# EAGLE design RGB LED 1.3 (EAGLE 5.04)
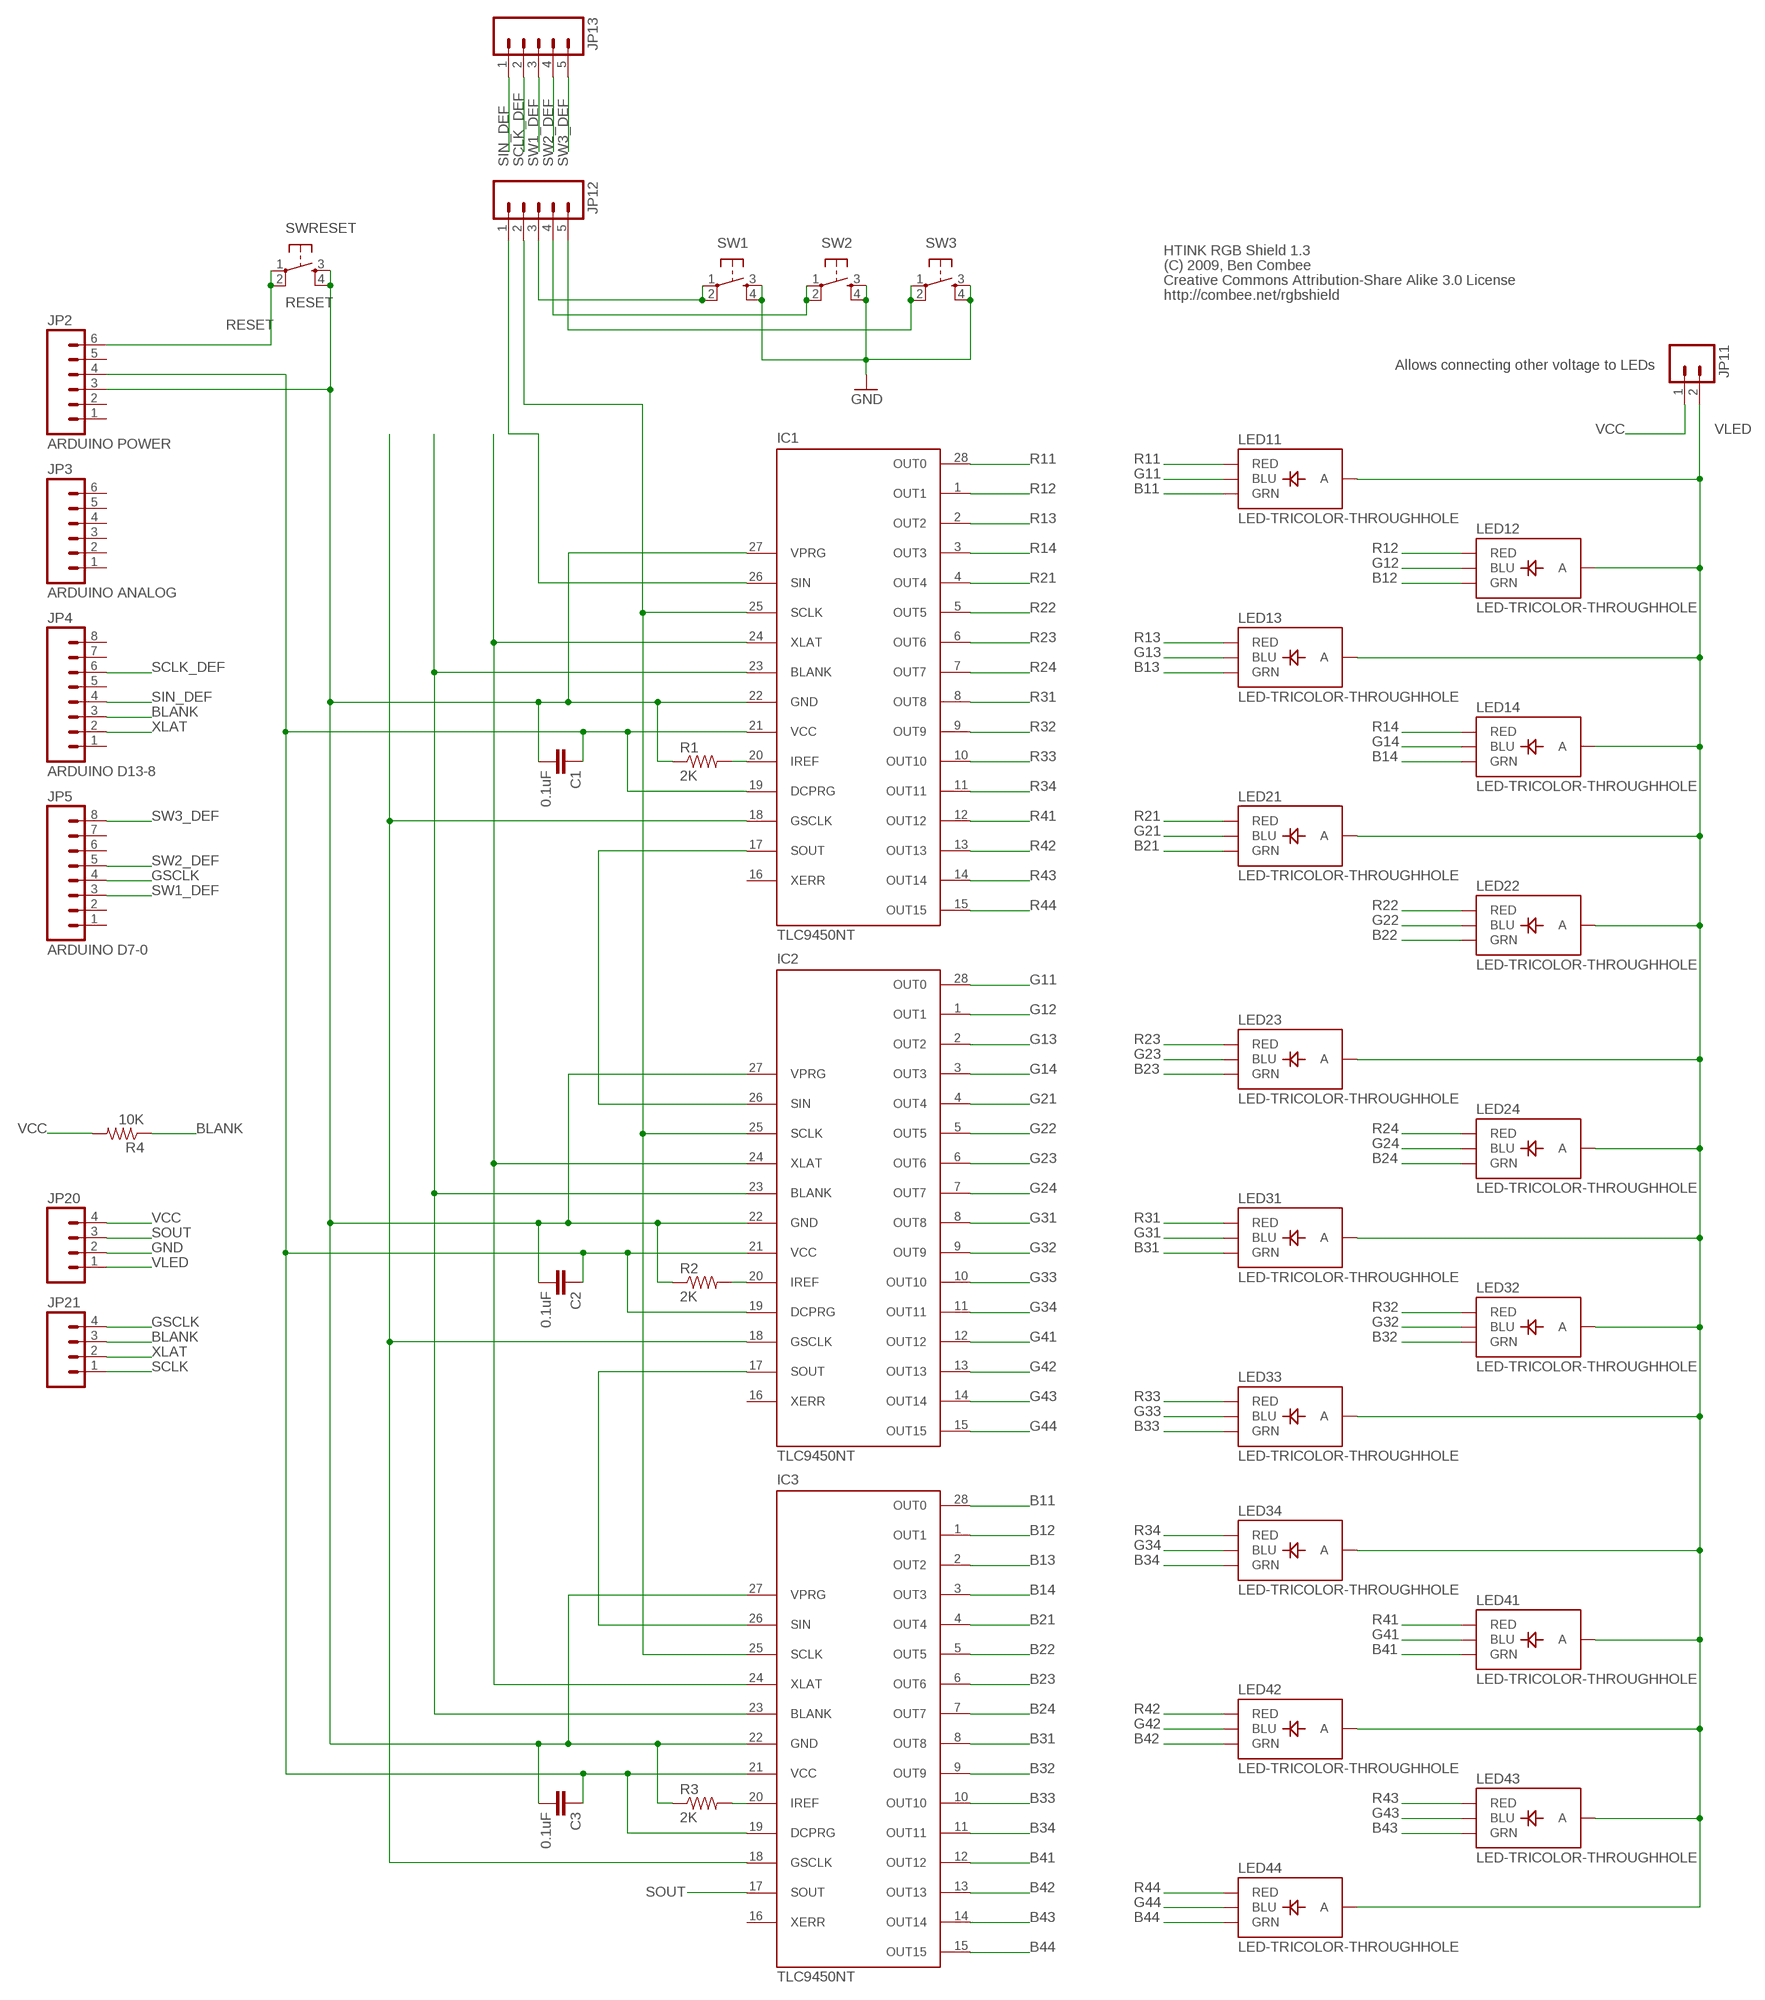
[diagram p0: schematic, sheet 1]

## Parts
C1  0.1uF  CAPPTH  [CAP-PTH-SMALL]
C2  0.1uF  CAPPTH  [CAP-PTH-SMALL]
C3  0.1uF  CAPPTH  [CAP-PTH-SMALL]
IC1  TLC9450NT  [DIL28-3]
IC2  TLC9450NT  [DIL28-3]
IC3  TLC9450NT  [DIL28-3]
JP2  ARDUINO POWER  M06LOCK  [1X06_LOCK]
JP3  ARDUINO ANALOG  M06LOCK  [1X06_LOCK]
JP4  ARDUINO D13-8  M08LOCK  [1X08_LOCK]
JP5  ARDUINO D7-0  M08LOCK  [1X08_LOCK]
JP11  M02LOCK  [1X02_LOCK]
JP12  M05LOCK  [1X05_LOCK]
JP13  M05LOCK  [1X05_LOCK]
JP20  M04LOCK  [1X04_LOCK]
JP21  M04LOCK  [1X04_LOCK]
LED11  LED-TRICOLOR-THROUGHHOLE  [LED-TRICOLOR-THROUGHHOLE]
LED12  LED-TRICOLOR-THROUGHHOLE  [LED-TRICOLOR-THROUGHHOLE]
LED13  LED-TRICOLOR-THROUGHHOLE  [LED-TRICOLOR-THROUGHHOLE]
LED14  LED-TRICOLOR-THROUGHHOLE  [LED-TRICOLOR-THROUGHHOLE]
LED21  LED-TRICOLOR-THROUGHHOLE  [LED-TRICOLOR-THROUGHHOLE]
LED22  LED-TRICOLOR-THROUGHHOLE  [LED-TRICOLOR-THROUGHHOLE]
LED23  LED-TRICOLOR-THROUGHHOLE  [LED-TRICOLOR-THROUGHHOLE]
LED24  LED-TRICOLOR-THROUGHHOLE  [LED-TRICOLOR-THROUGHHOLE]
LED31  LED-TRICOLOR-THROUGHHOLE  [LED-TRICOLOR-THROUGHHOLE]
LED32  LED-TRICOLOR-THROUGHHOLE  [LED-TRICOLOR-THROUGHHOLE]
LED33  LED-TRICOLOR-THROUGHHOLE  [LED-TRICOLOR-THROUGHHOLE]
LED34  LED-TRICOLOR-THROUGHHOLE  [LED-TRICOLOR-THROUGHHOLE]
LED41  LED-TRICOLOR-THROUGHHOLE  [LED-TRICOLOR-THROUGHHOLE]
LED42  LED-TRICOLOR-THROUGHHOLE  [LED-TRICOLOR-THROUGHHOLE]
LED43  LED-TRICOLOR-THROUGHHOLE  [LED-TRICOLOR-THROUGHHOLE]
LED44  LED-TRICOLOR-THROUGHHOLE  [LED-TRICOLOR-THROUGHHOLE]
R1  2K  R-US_0309/12  [0309/12]
R2  2K  R-US_0309/12  [0309/12]
R3  2K  R-US_0309/12  [0309/12]
R4  10K  R-US_0309/12  [0309/12]
SW1  TAC_SWITCHPTH  [TACTILE-PTH]
SW2  TAC_SWITCHPTH  [TACTILE-PTH]
SW3  TAC_SWITCHPTH  [TACTILE-PTH]
SWRESET  RESET  TAC_SWITCHPTH  [TACTILE-PTH]

## Nets
B11: IC3.28(OUT0) LED11.GRN
B12: IC3.1(OUT1) LED12.GRN
B13: IC3.2(OUT2) LED13.GRN
B14: IC3.3(OUT3) LED14.GRN
B21: IC3.4(OUT4) LED21.GRN
B22: IC3.5(OUT5) LED22.GRN
B23: IC3.6(OUT6) LED23.GRN
B24: IC3.7(OUT7) LED24.GRN
B31: IC3.8(OUT8) LED31.GRN
B32: IC3.9(OUT9) LED32.GRN
B33: IC3.10(OUT10) LED33.GRN
B34: IC3.11(OUT11) LED34.GRN
B41: IC3.12(OUT12) LED41.GRN
B42: IC3.13(OUT13) LED42.GRN
B43: IC3.14(OUT14) LED43.GRN
B44: IC3.15(OUT15) LED44.GRN
BLANK: IC1.23(BLANK) IC2.23(BLANK) IC3.23(BLANK) JP4.3 JP21.3 R4.1
G11: IC2.28(OUT0) LED11.BLU
G12: IC2.1(OUT1) LED12.BLU
G13: IC2.2(OUT2) LED13.BLU
G14: IC2.3(OUT3) LED14.BLU
G21: IC2.4(OUT4) LED21.BLU
G22: IC2.5(OUT5) LED22.BLU
G23: IC2.6(OUT6) LED23.BLU
G24: IC2.7(OUT7) LED24.BLU
G31: IC2.8(OUT8) LED31.BLU
G32: IC2.9(OUT9) LED32.BLU
G33: IC2.10(OUT10) LED33.BLU
G34: IC2.11(OUT11) LED34.BLU
G41: IC2.12(OUT12) LED41.BLU
G42: IC2.13(OUT13) LED42.BLU
G43: IC2.14(OUT14) LED43.BLU
G44: IC2.15(OUT15) LED44.BLU
GND: C1.2 C2.2 C3.2 IC1.22(GND) IC1.27(VPRG) IC2.22(GND) IC2.27(VPRG) IC3.22(GND) IC3.27(VPRG) JP2.3 JP20.2 R1.1 R2.1 R3.1 SW1.3 SW1.4 SW2.3 SW2.4 SW3.3 SW3.4 SWRESET.3 SWRESET.4
GSCLK: IC1.18(GSCLK) IC2.18(GSCLK) IC3.18(GSCLK) JP5.4 JP21.4
N$1: IC1.17(SOUT) IC2.26(SIN)
N$2: IC2.17(SOUT) IC3.26(SIN)
N$3: JP12.3 SW1.1 SW1.2
N$4: IC3.20(IREF) R3.2
N$5: IC2.20(IREF) R2.2
N$6: IC1.20(IREF) R1.2
N$32: JP12.4 SW2.1 SW2.2
N$33: JP12.5 SW3.1 SW3.2
R11: IC1.28(OUT0) LED11.RED
R12: IC1.1(OUT1) LED12.RED
R13: IC1.2(OUT2) LED13.RED
R14: IC1.3(OUT3) LED14.RED
R21: IC1.4(OUT4) LED21.RED
R22: IC1.5(OUT5) LED22.RED
R23: IC1.6(OUT6) LED23.RED
R24: IC1.7(OUT7) LED24.RED
R31: IC1.8(OUT8) LED31.RED
R32: IC1.9(OUT9) LED32.RED
R33: IC1.10(OUT10) LED33.RED
R34: IC1.11(OUT11) LED34.RED
R41: IC1.12(OUT12) LED41.RED
R42: IC1.13(OUT13) LED42.RED
R43: IC1.14(OUT14) LED43.RED
R44: IC1.15(OUT15) LED44.RED
RESET: JP2.6 SWRESET.1 SWRESET.2
SCLK: IC1.25(SCLK) IC2.25(SCLK) IC3.25(SCLK) JP12.2 JP21.1
SCLK_DEF: JP4.6 JP13.2
SIN: IC1.26(SIN) JP12.1
SIN_DEF: JP4.4 JP13.1
SOUT: IC3.17(SOUT) JP20.3
SW1_DEF: JP5.3 JP13.3
SW2_DEF: JP5.5 JP13.4
SW3_DEF: JP5.8 JP13.5
VCC: C1.1 C2.1 C3.1 IC1.19(DCPRG) IC1.21(VCC) IC2.19(DCPRG) IC2.21(VCC) IC3.19(DCPRG) IC3.21(VCC) JP2.4 JP11.1 JP20.4 R4.2
VLED: JP11.2 JP20.1 LED11.GND(A) LED12.GND(A) LED13.GND(A) LED14.GND(A) LED21.GND(A) LED22.GND(A) LED23.GND(A) LED24.GND(A) LED31.GND(A) LED32.GND(A) LED33.GND(A) LED34.GND(A) LED41.GND(A) LED42.GND(A) LED43.GND(A) LED44.GND(A)
XLAT: IC1.24(XLAT) IC2.24(XLAT) IC3.24(XLAT) JP4.2 JP21.2
Unconnected: IC1.16(XERR) IC2.16(XERR) IC3.16(XERR) JP2.1 JP2.2 JP2.5 JP3.1 JP3.2 JP3.3 JP3.4 JP3.5 JP3.6 JP4.1 JP4.5 JP4.7 JP4.8 JP5.1 JP5.2 JP5.6 JP5.7

## Notes on the sheet
- HTINK RGB Shield 1.3
- (C) 2009, Ben Combee
- Creative Commons Attribution-Share Alike 3.0 License
- http://combee.net/rgbshield
- Allows connecting other voltage to LEDs

## Library data of the parts
C1-C3 = SparkFun:CAP: Capacitor Standard 0603 ceramic capacitor, and 0.1" leaded capacitor.
IC1-IC3 = combee:TLC9450NT: TI TLC5940 16 Channel LED Driver
JP2 JP3 = SparkFun:M06: Header 6 Standard 6-pin 0.1" header. Use with straight break away headers (SKU : PRT-00116), right angle break away headers (PRT-00553), swiss pins (PRT-00743), machine pins (PRT-00117), and female headers (PRT-00115). Molex polarized connector foot print use with SKU : PRT-08094 with associated crimp pins and housings. NOTES ON THE VARIANTS LOCK and LOCK_LONGPADS... This footprint was designed to help hold the alignment of a through-hole component (i.e. 6-pin header) while soldering it into place. You may notice that each hole has been shifted either up or down by 0.005 of an inch from it's more standard position (which is a perfectly straight line). This slight alteration caused the pins (the squares in the middle) to touch the edges of the holes. Because they are alternating, it causes a "brace" to hold the component in place. 0.005 has proven to be the perfect amount of "off-center" position when using our standard breakaway headers. Although looks a little odd when you look at the bare footprint, once you have a header in there, the alteration is very hard to notice. Also, if you push a header all the way into place, it is covered up entirely on the bottom side. This idea of altering the position of holes to aid alignment will be further integrated into the Sparkfun Library for other footprints. It can help hold any component with 3 or more connection pins.
JP4 JP5 = SparkFun:M08: Header 8 Standard 8-pin 0.1" header. Use with straight break away headers (SKU : PRT-00116), right angle break away headers (PRT-00553), swiss pins (PRT-00743), machine pins (PRT-00117), and female headers (PRT-00115).
JP11 = SparkFun:M02: Header 2 Standard 2-pin 0.1" header. Use with straight break away headers (SKU : PRT-00116), right angle break away headers (PRT-00553), swiss pins (PRT-00743), machine pins (PRT-00117), and female headers (PRT-00115). Molex polarized connector foot print use with SKU : PRT-08233 with associated crimp pins and housings.
JP12 JP13 = SparkFun:M05: Header 5 Standard 5-pin 0.1" header. Use with straight break away headers (SKU : PRT-00116), right angle break away headers (PRT-00553), swiss pins (PRT-00743), machine pins (PRT-00117), and female headers (PRT-00115). Molex polarized connector foot print use with SKU : PRT-08230 with associated crimp pins and housings.
JP20 JP21 = SparkFun:M04: Header 4 Standard 4-pin 0.1" header. Use with straight break away headers (SKU : PRT-00116), right angle break away headers (PRT-00553), swiss pins (PRT-00743), machine pins (PRT-00117), and female headers (PRT-00115). Molex polarized connector foot print use with SKU : PRT-08231 with associated crimp pins and housings.
LED11-LED14 LED21-LED24 LED31-LED34 LED41-LED44 = SparkFun:LED-TRICOLOR-THROUGHHOLE
R1-R4 = resistor:R-US_: RESISTOR, American symbol
SW1-SW3 SWRESET = SparkFun:TAC_SWITCH: Momentary Switch Button commonly used for reset or general input. Spark Fun Electronics SKU : COM-00097

## Board
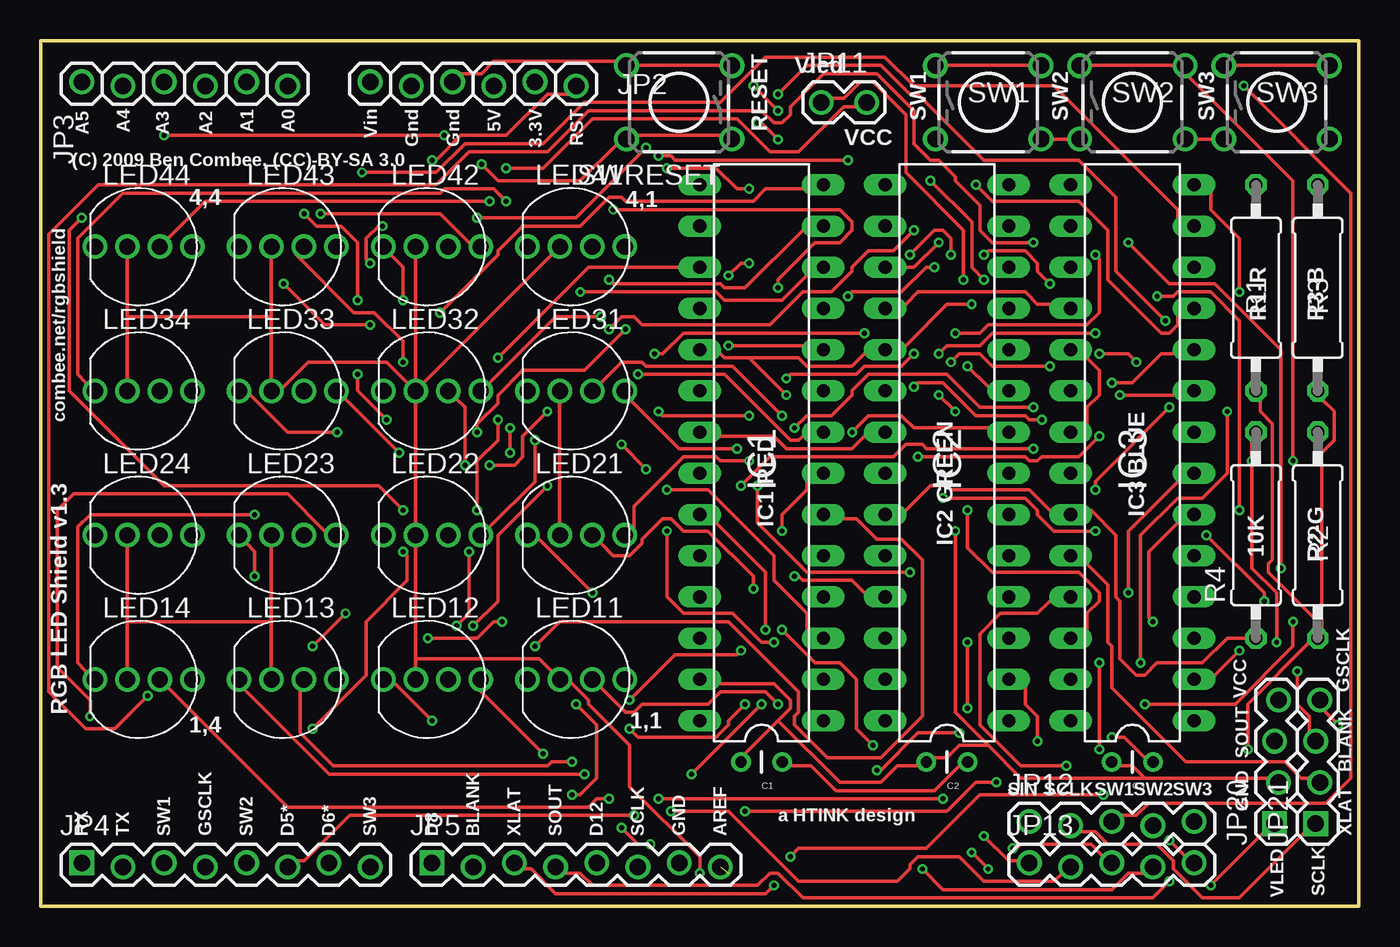
[diagram p1: board, top side]
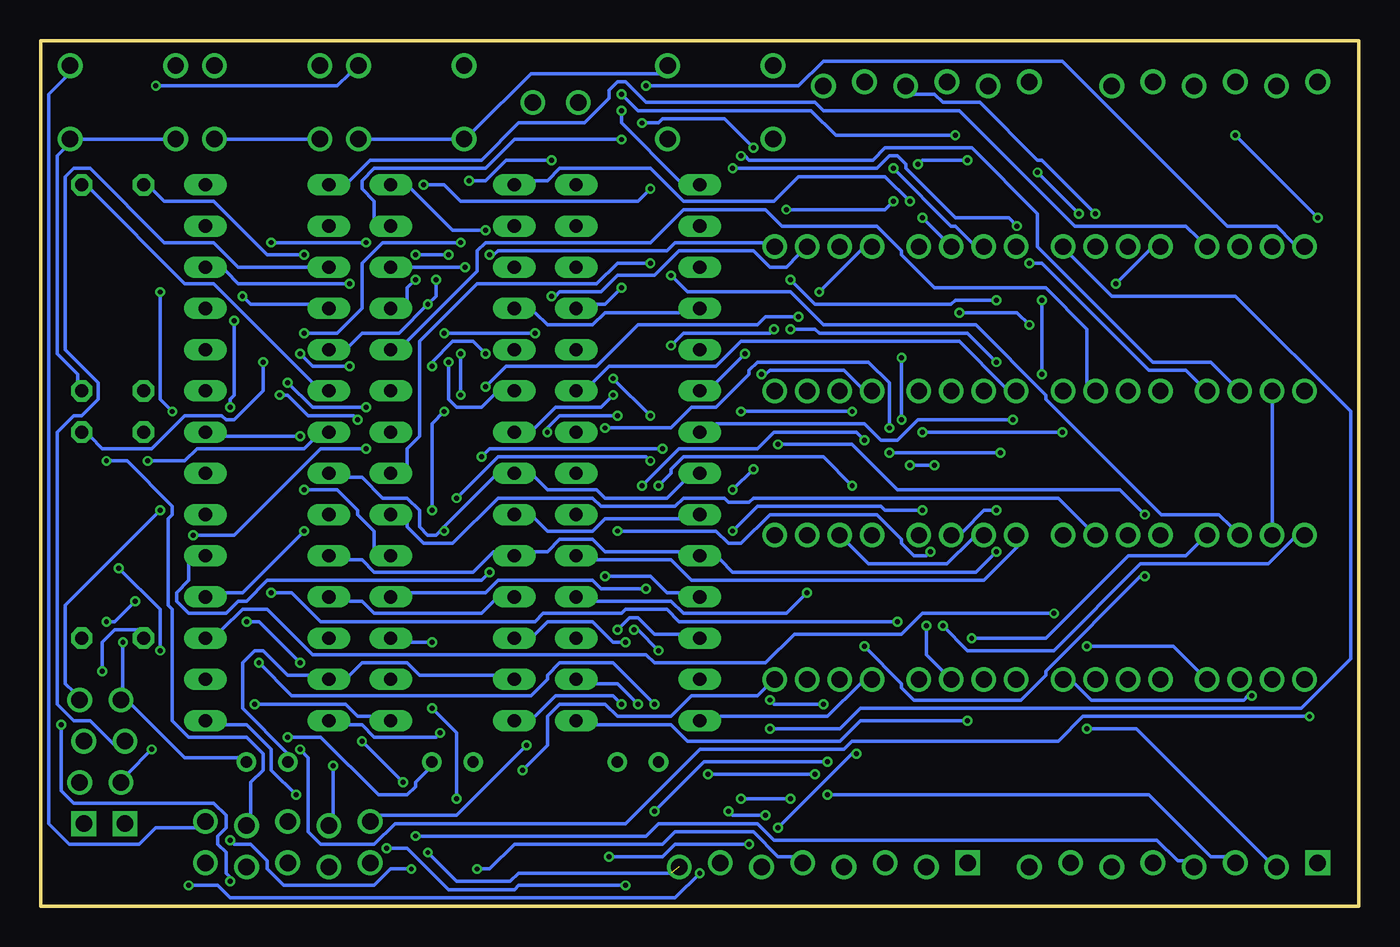
[diagram p2: board, bottom side, seen from below]

Size 81.28 x 53.34 mm. Coordinates in mm from the lower left corner, seen from the top.
Outline: 0,0 81.28,0 81.28,53.34 0,53.34 0,0
Copper layers (1*16): Top 0.035mm / dielectric 1.5mm / Bottom 0.035mm
Design rules "rule_manufacture": minimum track width 8mil, minimum drill 12mil, track to track 8mil, track to pad 8mil, pad to pad 6mil, via to via 10mil, smd to smd 0mil, copper to edge 10mil, drill to drill 10mil, minimum pad ring 10mil, minimum via ring 6mil, stop-mask expansion 2mil, vias tented up to drill 25mil, thermal gap 10mil

### Footprints (pad centres in the part's own frame; a part is rotated, then mirrored left to right if it is on the bottom)
CAP-PTH-SMALL = drill 0.7 round: 1 0,0; 2 2.54,0
DIL28-3 = drill 0.813 long: 1 -16.51,-3.81; 2 -13.97,-3.81; 3 -11.43,-3.81; 4 -8.89,-3.81; 5 -6.35,-3.81; 6 -3.81,-3.81; 7 -1.27,-3.81; 8 1.27,-3.81; 9 3.81,-3.81; 10 6.35,-3.81; 11 8.89,-3.81; 12 11.43,-3.81; 13 13.97,-3.81; 14 16.51,-3.81; 15 16.51,3.81; 16 13.97,3.81; 17 11.43,3.81; 18 8.89,3.81; 19 6.35,3.81; 20 3.81,3.81; 21 1.27,3.81; 22 -1.27,3.81; 23 -3.81,3.81; 24 -6.35,3.81; 25 -8.89,3.81; 26 -11.43,3.81; 27 -13.97,3.81; 28 -16.51,3.81
1X06_LOCK = drill 1.016 round: 1 0,0; 2 2.54,-0.254; 3 5.08,0; 4 7.62,-0.254; 5 10.16,0; 6 12.7,-0.254
1X08_LOCK = drill 1.016 square: 1 0,0.127 | drill 1.016 round: 2 2.54,-0.127; 3 5.08,0.127; 4 7.62,-0.127; 5 10.16,0.127; 6 12.7,-0.127; 7 15.24,0.127; 8 17.78,-0.127
1X02_LOCK = drill 1.016 round: 1 -0.127,0; 2 2.667,0
1X05_LOCK = drill 1.016 round: 1 0,0.127; 2 2.54,-0.127; 3 5.08,0.127; 4 7.62,-0.127; 5 10.16,0.127
1X04_LOCK = drill 1.016 square: 1 0,0.127 | drill 1.016 round: 2 2.54,-0.127; 3 5.08,0.127; 4 7.62,-0.127
LED-TRICOLOR-THROUGHHOLE = drill 1 round: BLU 1,0; GND -1,0; GRN 3,0; RED -3,0
0309/12 = drill 0.813 octagon: 1 -6.35,0; 2 6.35,0
TACTILE-PTH = drill 1.016 round: 1 -3.251,2.261; 2 3.251,2.261; 3 -3.251,-2.261; 4 3.251,-2.261

### Placement (x,y rotation side)
C1  45.72,8.89 180 top
C2  57.15,8.89 180 top
C3  68.58,8.89 180 top
IC1  44.45,27.94 90 top
IC2  55.88,27.94 90 top
IC3  67.31,27.94 90 top
JP2  20.32,50.8 0 top
JP3  2.54,50.8 0 top
JP4  2.54,2.54 0 top
JP5  24.13,2.54 0 top
JP11  48.26,49.53 0 top
JP12  60.96,5.08 0 top
JP13  60.96,2.54 0 top
JP20  76.2,5.08 90 top
JP21  78.74,5.08 90 top
LED11  33.02,13.97 0 top
LED12  24.13,13.97 0 top
LED13  15.24,13.97 0 top
LED14  6.35,13.97 0 top
LED21  33.02,22.86 0 top
LED22  24.13,22.86 0 top
LED23  15.24,22.86 0 top
LED24  6.35,22.86 0 top
LED31  33.02,31.75 0 top
LED32  24.13,31.75 0 top
LED33  15.24,31.75 0 top
LED34  6.35,31.75 0 top
LED41  33.02,40.64 0 top
LED42  24.13,40.64 0 top
LED43  15.24,40.64 0 top
LED44  6.35,40.64 0 top
R1  74.93,38.1 90 top
R2  78.74,22.86 90 top
R3  78.74,38.1 90 top
R4  74.93,22.86 90 top
SW1  58.42,49.53 0 top
SW2  67.31,49.53 0 top
SW3  76.2,49.53 0 top
SWRESET  39.37,49.53 180 top

### Tracks (layer width: path | path; a pad name or v marks a point on that pad's centre or on a via)
B11  (via drill 0.3)
  Top 0.203: v56.64,10.67 54.1,10.67 51.82,8.38 v51.56,8.38
  Bottom 0.203: v56.64,10.67 56.9,10.41 60.71,10.41 61.47,11.18 62.23,11.18 IC3.28 | v51.56,8.38 50.04,9.91 50.04,11.68 49.28,12.45 46.48,12.45 45.72,11.68 42.42,11.68 41.15,12.95 37.08,12.95 36.58,13.46 LED11.GRN
B12  (via drill 0.3)
  Top 0.203: v65.53,6.86 57.91,6.86 54.61,3.56 46.74,3.56 v46.23,3.05 | v37.59,3.81 36.83,3.81 v35.81,4.83 | v30.99,9.4 26.92,13.46 LED12.GRN
  Bottom 0.203: v65.53,6.86 67.06,8.38 67.06,9.65 68.58,11.18 69.85,11.18 IC3.1 | v46.23,3.05 42.93,3.05 42.16,3.81 v37.59,3.81 | v35.81,4.83 31.24,9.4 v30.99,9.4
B13  (via drill 0.3)
  Top 0.203: v73.91,15.75 72.39,14.22 IC3.2 | v76.45,20.83 76.45,34.29 72.39,38.35 69.6,38.35 v67.06,40.89 | v61.21,40.89 58.67,40.89 57.91,41.66 57.91,43.18 56.39,44.7 56.39,44.96 55.37,45.97 54.86,45.97 53.85,46.99 53.85,49.02 51.56,51.31 48.26,51.31 46.23,49.28 46.23,48.77 45.72,48.26 45.21,48.26 44.45,49.02 33.78,49.02 31.24,46.48 26.42,46.48 24.38,44.45 3.56,44.45 0.51,41.4 0.51,13.21 2.79,10.92 4.57,10.92 v6.6,12.95
  Bottom 0.203: v73.91,15.75 73.91,18.29 v76.45,20.83 | v61.21,40.89 v67.06,40.89 | v6.6,12.95 6.86,12.95 7.11,12.7 16.51,12.7 17.53,13.72 LED13.GRN
B14  (via drill 0.3)
  Top 0.203: v16.76,16 v18.8,18.03
  Bottom 0.203: v18.8,18.03 26.92,18.03 28.19,16.76 34.8,16.76 36.58,14.99 43.43,14.99 43.94,15.49 64.52,15.49 67.31,18.29 68.83,18.29 70.1,17.02 IC3.3 | v16.76,16 11.43,16 9.91,14.48 LED14.GRN
B21  (via drill 0.3)
  Top 0.203: v65.02,23.11 62.48,23.11 61.47,24.13 61.47,24.38 60.71,25.15 v55.63,25.15 | v43.69,27.43 41.91,27.43 41.66,27.69 39.62,27.69 36.58,24.64 36.58,23.37 LED21.GRN
  Bottom 0.203: v65.02,23.11 68.83,19.3 69.85,19.3 IC3.4 | v55.63,25.15 53.09,27.69 43.94,27.69 v43.69,27.43
B22  (via drill 0.3)
  Top 0.203: v53.59,20.57 47.24,20.57 44.2,23.62 v44.2,25.91 | v30.48,28.7 30.48,26.16 27.69,23.37 LED22.GRN
  Bottom 0.203: v53.59,20.57 54.1,20.07 67.31,20.07 68.58,18.8 69.09,18.8 69.85,18.03 72.14,18.03 72.9,18.8 72.9,19.3 72.14,20.07 72.14,21.08 IC3.5 | v44.2,25.91 41.91,28.19 37.08,28.19 36.07,29.21 30.99,29.21 v30.48,28.7
B23  (via drill 0.3)
  Top 0.203: v68.58,17.53 68.33,17.78 68.33,21.84 70.1,23.62 IC3.6 | v65.28,9.65 v65.28,14.99 | v3.05,11.68 3.05,12.7 1.02,14.73 1.02,24.38 2.03,25.4 15.24,25.4 17.53,23.11 LED23.GRN
  Bottom 0.203: v68.58,17.53 67.82,17.53 v65.28,14.99 | v65.28,9.65 64.77,9.14 64.77,4.57 64.01,3.81 60.71,3.81 59.44,5.08 45.21,5.08 40.64,9.65 31.75,9.65 31.24,10.16 18.54,10.16 17.02,11.68 v3.05,11.68
B24  (via drill 0.3)
  Top 0.203: v67.06,19.3 67.06,23.11 70.1,26.16 IC3.7 | v28.45,17.53 27.94,17.53 26.92,16.51 v23.88,16.51
  Bottom 0.203: v67.06,19.3 65.79,19.3 64.01,17.53 50.8,17.53 50.29,18.03 45.47,18.03 45.21,18.29 42.67,18.29 41.91,17.53 v28.45,17.53 | v23.88,16.51 19.3,16.51 14.22,21.59 10.67,21.59 9.91,22.35 LED24.GRN
B31  (via drill 0.3)
  Top 0.203: v65.28,28.96 64.01,27.69 61.72,27.69 61.47,27.43 60.96,27.43 60.71,27.69 v54.1,27.69 | v42.93,28.19 39.37,28.19 36.32,31.24 LED31.GRN
  Bottom 0.203: v65.28,28.96 69.85,28.96 IC3.8 | v54.1,27.69 53.59,28.19 v42.93,28.19
B32  (via drill 0.3)
  Top 0.203: v66.55,31.5 69.85,31.5 IC3.9 | v61.72,29.97 60.96,29.97 60.71,30.23 57.66,30.23 55.63,32.26 54.1,32.26 v53.85,32 | v34.54,36.32 31.75,36.32 27.69,32.26 LED32.GRN
  Bottom 0.203: v66.55,31.5 66.04,31.5 64.77,30.23 61.98,30.23 v61.72,29.97 | v53.85,32 52.58,33.27 46.99,33.27 44.45,35.81 37.08,35.81 36.58,36.32 v34.54,36.32
B33  (via drill 0.3)
  Top 0.203: v66.04,32.26 67.31,32.26 69.09,34.04 69.85,34.04 IC3.10 | v61.21,30.73 57.91,30.73 55.88,32.77 51.05,32.77 50.04,31.75 50.04,31.5 48.77,30.23 47.24,30.23 v46.48,29.46 | v28.96,27.94 v28.96,29.46 | v22.1,27.94 18.8,31.24 LED33.GRN
  Bottom 0.203: v66.04,32.26 64.52,30.73 v61.21,30.73 | v46.48,29.46 42.42,29.46 41.15,30.73 39.62,30.73 37.59,32.77 37.59,33.02 37.08,33.53 30.23,33.53 28.96,32.26 v28.96,29.46 | v22.1,27.94 v28.96,27.94
B34  (via drill 0.3)
  Top 0.203: v57.66,44.45 58.67,43.43 64.01,43.43 65.79,41.66 65.79,38.61 69.09,35.31 69.6,35.31 70.1,35.81 70.1,36.32 IC3.11 | v43.69,44.2 42.93,44.2 41.66,45.47 v38.61,45.47 | v21.08,41.91 20.83,41.91 20.07,41.15 20.07,39.88 v20.32,39.62
  Bottom 0.203: v57.66,44.45 56.39,44.45 55.37,43.43 44.45,43.43 v43.69,44.2 | v38.61,45.47 29.72,45.47 28.96,46.23 28.45,46.23 27.94,45.72 27.94,45.47 24.89,42.42 21.59,42.42 v21.08,41.91 | v20.32,39.62 19.56,39.62 12.95,33.02 10.67,33.02 9.91,32.26 LED34.GRN
B41  (via drill 0.3)
  Top 0.203: v62.23,38.35 61.47,39.12 61.47,39.62 60.71,40.39 58.42,40.39 v58.17,40.13 | v56.13,40.13 56.13,41.15 55.63,41.66 55.12,41.66 v53.59,40.13
  Bottom 0.203: v62.23,38.35 69.09,38.35 69.85,39.12 IC3.12 | v56.13,40.13 v58.17,40.13 | v53.59,40.13 53.34,40.13 53.09,40.39 42.67,40.39 42.16,40.89 36.58,40.89 LED41.GRN
B42  (via drill 0.3)
  Top 0.203: v19.81,45.21 24.38,45.21 26.16,46.99 30.99,46.99 33.53,49.53 41.91,49.53 44.7,52.32 52.07,52.32 53.85,50.55 62.48,50.55 70.1,42.93 70.1,42.42 IC3.13 | v17.27,42.67 24.64,42.67 26.42,40.89 LED42.GRN
  Bottom 0.203: v17.27,42.67 v19.81,45.21
B43  (via drill 0.3)
  Top 0.203: v73.91,37.85 73.91,41.15 72.14,42.93 72.14,43.94 IC3.14 | v73.15,30.48 73.15,26.67 71.63,25.15 70.1,25.15 67.82,22.86 v67.82,14.99 | v43.43,12.45 42.42,11.43 42.42,11.18 41.66,10.41 36.83,10.41 v36.32,10.92
  Bottom 0.203: v73.91,37.85 73.91,31.24 v73.15,30.48 | v67.82,14.99 65.79,12.95 51.05,12.95 50.04,13.97 50.04,14.22 49.28,14.99 45.97,14.99 v43.43,12.45 | v36.32,10.92 32,10.92 30.73,12.19 3.56,12.19 0.51,15.24 0.51,30.48 7.62,37.59 15.24,37.59 17.78,40.13 LED43.GRN
B44
  Bottom 0.203: IC3.15 62.23,44.7 60.96,45.97 54.1,45.97 51.82,48.26 47.75,48.26 46.23,49.78 46.23,50.29 45.72,50.8 45.21,50.8 43.94,49.53 33.53,49.53 33.02,49.02 24.64,49.02 17.53,41.91 10.67,41.91 9.91,41.15 LED44.GRN
BLANK  (via drill 0.3)
  Top 0.203: IC2.23 53.34,24.38 54.86,25.91 55.88,25.91 56.13,25.65 60.96,25.65 62.23,24.38 IC3.23 64.77,24.38 66.29,22.86 66.29,19.05 66.55,18.8 66.55,15.24 67.56,14.22 68.07,14.22 68.83,14.99 71.63,14.99 73.15,16.51 R4.1 | v32.77,6.86 33.27,6.86 34.29,7.87 34.29,11.18 v33.02,12.45 | v36.32,12.7 39.12,15.49 42.93,15.49 v43.18,15.75 | v44.7,17.02 44.7,20.57 41.66,23.62 IC1.23 | v77.47,14.48 77.47,12.45 78.23,11.68 78.23,10.67 JP21.3
  Bottom 0.203: IC1.23 41.91,23.88 46.48,23.88 47.24,23.11 50.04,23.11 50.8,23.88 IC2.23 | v32.77,6.86 12.95,6.86 9.14,3.05 8.13,3.05 JP4.3 | v33.02,12.45 36.07,12.45 v36.32,12.7 | v43.18,15.75 44.45,17.02 v44.7,17.02 | v77.47,14.48 77.47,16.26 76.71,17.02 75.18,17.02 R4.1
G11  (via drill 0.3)
  Top 0.203: v45.47,12.45 44.7,13.21 41.91,13.21 41.15,12.45 37.08,12.45 36.58,11.94 36.07,11.94 34.54,13.46 LED11.BLU
  Bottom 0.203: v45.47,12.45 45.97,12.95 49.53,12.95 50.8,11.68 IC2.28
G12  (via drill 0.3)
  Top 0.203: v68.07,12.45 73.66,12.45 77.22,16 v77.22,17.53 | v75.44,18.8 75.44,19.3 v71.88,22.86 | v61.21,28.19 54.61,28.19 54.36,28.45 53.34,28.45 52.58,27.69 44.96,27.69 v43.18,25.91 | v31.24,25.91 28.19,22.86 28.19,18.8 v26.67,17.27
  Bottom 0.203: v68.07,12.45 62.48,12.45 61.72,11.68 60.96,11.68 IC2.1 | v77.22,17.53 76.71,17.53 v75.44,18.8 | v71.88,22.86 69.34,22.86 64.01,28.19 v61.21,28.19 | v43.18,25.91 42.42,26.67 42.42,26.92 41.66,27.69 33.02,27.69 v31.24,25.91 | v26.67,17.27 26.67,15.49 25.65,14.48 LED12.BLU
G13  (via drill 0.3)
  Top 0.203: v61.47,10.16 61.47,11.68 60.71,12.45 60.71,13.46 IC2.2 | v58.93,7.62 57.66,7.62 55.88,5.84 v43.43,5.84 | v32.77,8.89 31.5,8.89 31.24,8.64 18.03,8.64 16,10.67 16,13.46 LED13.BLU
  Bottom 0.203: v58.93,7.62 v61.47,10.16 | v43.43,5.84 40.39,8.89 v32.77,8.89
G14  (via drill 0.3)
  Top 0.203: v57.15,12.19 v57.15,16.26 | v38.1,6.6 v55.63,6.6 | v35.05,6.6 34.29,6.6 33.78,6.1 15.24,6.1 7.87,13.46 LED14.BLU
  Bottom 0.203: v57.15,16.26 58.42,16.26 IC2.3 | v57.15,12.19 55.63,10.67 v55.63,6.6 | v35.05,6.6 v38.1,6.6
G21  (via drill 0.3)
  Top 0.203: v43.94,19.56 43.94,20.32 41.15,23.11 39.62,23.11 38.86,23.88 38.35,23.88 37.08,22.61 37.08,22.35 36.32,21.59 35.31,21.59 34.54,22.35 LED21.BLU
  Bottom 0.203: v43.94,19.56 46.74,19.56 47.24,20.07 53.09,20.07 53.85,19.3 58.42,19.3 IC2.4
G22  (via drill 0.3)
  Top 0.203: v65.02,25.65 65.02,26.16 v69.6,30.73 | v69.34,36.07 66.29,39.12 66.29,43.69 64.01,45.97 58.17,45.97 54.1,50.04 53.59,50.04 51.82,51.82 47.24,51.82 v45.47,50.04 | v7.62,47.5 v24.89,47.5 | v2.54,42.42 1.78,41.66 1.78,31.75 7.62,25.91 20.83,25.91 v22.35,24.38
  Bottom 0.203: v65.02,25.65 62.99,25.65 61.72,24.38 61.72,24.13 60.71,23.11 60.71,22.1 IC2.5 | v69.6,30.73 69.6,31.24 69.34,31.5 v69.34,36.07 | v45.47,50.04 44.45,49.02 33.78,49.02 32.26,47.5 v24.89,47.5 | v2.54,42.42 v7.62,47.5 | v22.35,24.38 23.11,24.38 24.38,23.11 LED22.BLU
G23
  Bottom 0.203: IC2.6 58.67,23.62 58.67,23.37 57.66,22.35 55.88,22.35 53.09,25.15 47.24,25.15 46.74,24.64 42.16,24.64 41.66,25.15 39.12,25.15 38.86,24.89 37.59,24.89 37.34,25.15 18.54,25.15 16.76,23.37 LED23.BLU
G24  (via drill 0.3)
  Top 0.203: v43.69,39.62 43.18,39.62 v42.42,38.86
  Bottom 0.203: v43.69,39.62 45.72,39.62 46.99,38.35 54.36,38.35 57.91,34.8 57.91,28.96 58.67,28.19 58.67,27.18 IC2.7 | v42.42,38.86 41.4,37.85 35.05,37.85 33.02,35.81 23.62,35.81 19.3,31.5 19.3,31.24 12.19,24.13 8.64,24.13 7.87,23.37 LED24.BLU
G31  (via drill 0.3)
  Top 0.203: v50.04,29.21 51.05,30.23 53.09,30.23 53.85,29.46 58.42,29.46 IC2.8 | v45.72,30.23 42.67,33.27 37.34,33.27 37.08,33.53 35.81,33.53 34.54,32.26 LED31.BLU
  Bottom 0.203: v50.04,29.21 50.04,29.46 49.28,30.23 v45.72,30.23
G32  (via drill 0.3)
  Top 0.203: v57.15,33.27 58.42,32 IC2.9 | v53.85,34.04 53.09,33.27 50.8,33.27 50.29,32.77 46.23,32.77 v45.97,32.51 | v43.69,30.23 38.35,30.23 v38.1,30.48 | v31.24,30.48 29.72,28.96 29.72,27.69 29.21,27.18 v27.69,27.18 | v26.16,27.18 26.16,30.73 25.65,31.24 LED32.BLU
  Bottom 0.203: v57.15,33.27 57.15,33.53 55.88,34.8 54.61,34.8 v53.85,34.04 | v43.69,30.23 v45.97,32.51 | v31.24,30.48 v38.1,30.48 | v26.16,27.18 v27.69,27.18
G33
  Bottom 0.203: IC2.10 58.67,34.8 54.36,39.12 54.36,40.39 53.85,40.89 43.69,40.89 41.66,42.93 36.58,42.93 35.56,41.91 29.72,41.91 28.19,40.39 28.19,40.13 26.16,38.1 19.3,38.1 16.76,35.56 16.76,32.26 LED33.BLU
G34  (via drill 0.3)
  Top 0.203: v58.17,38.61 57.4,39.37 57.4,42.16 v54.86,44.7 | v49.78,45.97 39.12,45.97 38.86,46.23 v38.1,46.23
  Bottom 0.203: v58.17,38.61 58.67,38.1 58.67,37.34 IC2.11 | v54.86,44.7 53.85,44.7 52.58,45.97 v49.78,45.97 | v38.1,46.23 37.85,46.23 37.59,45.97 29.97,45.97 29.21,46.74 23.88,46.74 19.81,42.67 19.81,40.64 12.7,33.53 9.14,33.53 7.87,32.26 LED34.BLU
G41  (via drill 0.3)
  Top 0.203: v55.12,39.37 54.61,39.37 53.09,37.85 50.04,37.85 v49.78,37.59
  Bottom 0.203: v49.78,37.59 49.53,37.59 49.28,37.85 46.74,37.85 45.72,38.86 43.43,38.86 41.91,40.39 37.34,40.39 36.32,39.37 35.31,39.37 34.54,40.13 LED41.BLU | v55.12,39.37 IC2.12
G42  (via drill 0.3)
  Top 0.203: v45.47,47.24 44.45,48.26 v44.2,48.26 | v37.34,46.74 33.02,42.42 v26.92,42.42
  Bottom 0.203: v45.47,47.24 52.07,47.24 53.85,45.47 60.71,45.47 61.47,44.7 61.47,44.2 60.71,43.43 60.71,42.42 IC2.13 | v44.2,48.26 43.18,48.26 42.93,48.51 39.12,48.51 v37.34,46.74 | v26.92,42.42 25.65,41.15 LED42.BLU
G43  (via drill 0.3)
  Top 0.203: v53.85,41.66 52.58,40.39 51.05,40.39 50.04,39.37 50.04,39.12 48.77,37.85 46.99,37.85 44.96,35.81 37.08,35.81 36.58,36.32 35.81,36.32 v35.05,35.56 | v22.35,33.53 22.35,34.8 20.57,36.58 19.3,36.58 15.75,40.13 LED43.BLU
  Bottom 0.203: v53.85,41.66 55.88,41.66 58.42,44.2 IC2.14 | v35.05,35.56 33.53,35.56 33.27,35.31 24.13,35.31 v22.35,33.53
G44  (via drill 0.3)
  Top 0.203: v27.69,43.43 10.16,43.43 7.87,41.15 LED44.BLU
  Bottom 0.203: v27.69,43.43 29.21,44.96 34.54,44.96 36.07,43.43 41.66,43.43 43.69,45.47 49.28,45.47 50.04,44.7 50.8,44.7 IC2.15
GND  (via drill 0.3)
  Top 0.203: 45.47,11.43 46.23,12.19 46.23,12.7 45.21,13.72 41.91,13.72 IC1.27 | 45.47,11.43 43.43,9.4 C1.2 | 45.47,11.43 49.28,7.62 51.82,7.62 52.83,8.64 54.1,8.64 C2.2 55.12,9.14 55.88,9.14 56.64,9.91 58.42,9.91 | 68.07,7.87 67.31,8.64 66.55,8.64 C3.2 | 68.07,7.87 75.69,7.87 JP20.2 | 58.42,9.91 60.45,7.87 68.07,7.87 | v56.39,23.11 56.39,11.94 58.42,9.91 | JP2.3 25.91,51.31 27.18,51.31 27.94,52.07 35.56,52.07 SWRESET.4 36.83,51.82 41.91,51.82 SWRESET.3 | 78.99,17.27 78.99,27.94 79.76,28.7 79.76,30.48 78.99,31.24 R3.1 | 78.99,17.27 78.99,17.02 R2.1 78.23,16.26 74.42,12.45 v74.42,9.65 | 78.99,17.27 75.69,20.57 75.69,21.08 75.95,21.34 75.95,29.72 75.18,30.48 75.18,31.24 R1.1 | SW2.3 63.5,47.24 62.23,47.24 SW1.4 | SW2.4 71.12,47.24 72.39,47.24 SW3.3
  Bottom 0.203: IC1.22 41.66,26.16 42.67,25.15 46.48,25.15 46.99,25.65 50.04,25.65 50.8,26.42 IC2.22 53.34,26.42 56.39,23.37 | 56.39,23.37 56.9,22.86 57.4,22.86 57.91,23.37 57.91,24.38 58.67,25.15 60.2,25.15 61.47,26.42 62.23,26.42 IC3.22 | IC2.27 53.34,14.22 57.91,14.22 58.67,14.99 61.47,14.99 62.23,14.22 IC3.27 64.77,14.22 66.04,14.22 67.56,15.75 68.07,15.75 68.83,14.99 68.83,12.19 66.04,9.4 C3.2 | v56.39,23.11 56.39,23.37 | SW1.4 60.96,47.24 55.88,47.24 SW1.3 54.61,47.75 51.05,51.31 43.18,51.31 SWRESET.3 | SW3.3 73.66,47.24 78.74,47.24 SW3.4 79.76,46.74 80.26,46.23 80.26,34.04 78.99,32.77 78.99,32.26 R3.1 | SW2.3 64.77,47.24 69.85,47.24 SW2.4 | v74.42,9.65 75.95,8.13 JP20.2
GSCLK  (via drill 0.3)
  Top 0.203: IC3.18 62.23,37.08 61.47,37.08 60.71,37.85 54.1,37.85 53.34,37.08 IC2.18 | v69.6,1.52 68.58,0.51 46.99,0.51 45.47,2.03 44.96,2.03 44.2,1.27 34.04,1.27 33.27,2.03 32.26,2.03 JP5.4 | v80.01,11.18 78.99,12.19 JP21.4 | v68.83,37.59 69.85,37.59 70.1,37.85 72.14,37.85 73.91,36.07 v73.91,24.38
  Bottom 0.203: IC1.18 41.91,36.58 46.48,36.58 47.24,35.81 50.04,35.81 50.8,36.58 IC2.18 | v69.6,1.52 69.6,1.78 69.85,2.03 69.85,3.3 70.36,3.81 70.36,4.32 69.85,4.83 69.85,5.59 70.61,6.35 79.25,6.35 80.01,7.11 v80.01,11.18 | v68.83,37.59 68.33,37.08 64.77,37.08 IC3.18 | v73.91,24.38 79.76,18.54 79.76,13.72 79.25,13.21 JP21.4
N$1  (via drill 0.3)
  Top 0.203: v28.19,33.78 33.78,39.37 IC1.17 | v28.19,29.97 28.19,28.7 26.92,27.43 v26.92,24.38 | v38.61,23.11 38.61,19.05 39.62,18.03 42.67,18.03 44.45,16.26 v45.21,16.26
  Bottom 0.203: v28.19,29.97 v28.19,33.78 | v26.92,24.38 29.21,24.38 29.46,24.64 37.08,24.64 v38.61,23.11 | v45.21,16.26 45.97,16.26 47.24,17.53 50.04,17.53 50.8,16.76 IC2.26
N$2  (via drill 0.3)
  Top 0.203: v57.15,24.38 57.15,22.1 58.67,20.57 64.01,20.57 65.28,19.3 65.28,18.8 64.52,18.03 64.52,17.02 IC3.26 | v56.39,30.48 v55.37,31.5 | v55.37,34.04 55.88,34.54 57.91,34.54 58.67,35.31 v65.02,35.31 | v55.37,40.89 53.85,39.37 IC2.17
  Bottom 0.203: v57.15,24.38 57.15,29.72 v56.39,30.48 | v55.37,31.5 v55.37,34.04 | v65.02,35.31 62.99,35.31 61.47,36.83 61.47,39.62 60.2,40.89 v55.37,40.89
N$3  (via drill 0.3)
  Top 0.203: SW1.1 55.88,51.82 60.96,51.82 SW1.2 | v74.17,50.55 80.77,43.94 80.77,7.87 79.25,6.35 68.33,6.35 67.56,5.59 66.55,5.59 JP12.3
  Bottom 0.203: v74.17,50.55 62.99,50.55 62.23,51.31 SW1.2
N$4
  Bottom 0.203: IC3.20 64.52,32.26 70.61,38.35 72.39,38.35 78.23,44.2 R3.2
N$5  (via drill 0.3)
  Top 0.203: v56.13,33.53 56.64,34.04 57.91,34.04 58.67,33.27 v62.23,33.27 | v65.28,34.04 67.06,34.04 v67.56,33.53
  Bottom 0.203: v56.13,33.53 56.13,31.24 55.63,30.73 54.1,30.73 53.34,31.5 IC2.20 | v62.23,33.27 64.52,33.27 v65.28,34.04 | v67.56,33.53 67.56,31.75 69.34,29.97 69.85,29.97 70.1,30.23 72.39,30.23 74.42,28.19 77.47,28.19 78.23,28.96 R2.2
N$6  (via drill 0.3)
  Top 0.203: v37.85,34.04 38.35,34.04 39.62,35.31 v50.8,35.31 | v56.39,35.31 57.91,35.31 58.42,35.81 64.52,35.81 65.28,36.58 65.28,39.88 v65.02,40.13
  Bottom 0.203: v37.85,34.04 39.62,32.26 IC1.20 | v50.8,35.31 v56.39,35.31 | v65.02,40.13 67.31,40.13 70.61,43.43 73.66,43.43 74.42,44.2 R1.2
N$32  (via drill 0.3)
  Top 0.203: v77.22,27.43 77.22,44.7 70.87,51.05 SW2.2 69.85,51.82 64.77,51.82 SW2.1
  Bottom 0.203: v77.22,27.43 75.95,27.43 73.15,24.64 73.15,24.13 73.41,23.88 73.41,18.54 73.15,18.29 73.15,11.43 72.14,10.41 68.58,10.41 67.56,9.4 67.56,8.38 68.33,7.62 68.33,5.59 JP12.4
N$33
  Top 0.203: SW3.1 73.66,51.82 78.74,51.82 SW3.2
  Bottom 0.203: JP12.5 71.63,4.83 74.17,4.83 75.18,3.81 79.5,3.81 80.77,5.08 80.77,50.04 79.76,51.05 SW3.2
R11
  Bottom 0.203: IC1.28 39.37,11.68 32.77,11.68 30.73,13.72 LED11.RED
R12  (via drill 0.3)
  Top 0.203: v24.13,11.43 21.84,13.72 LED12.RED
  Bottom 0.203: v24.13,11.43 30.73,11.43 32,10.16 41.4,10.16 42.42,11.18 46.99,11.18 IC1.1
R13  (via drill 0.3)
  Top 0.203: v40.13,8.13 v44.45,12.45 | v33.53,8.13 17.78,8.13 12.45,13.46 LED13.RED
  Bottom 0.203: v44.45,12.45 45.72,13.72 46.99,13.72 IC1.2 | v33.53,8.13 v40.13,8.13
R14  (via drill 0.3)
  Top 0.203: v38.61,25.65 41.15,25.65 45.21,21.59 45.21,20.07 47.24,18.03 47.24,17.02 IC1.3 | v35.81,28.45 v37.34,26.92 | v13.21,24.13 3.05,24.13 2.29,23.37 2.29,14.99 2.79,14.48 LED14.RED
  Bottom 0.203: v37.34,26.92 v38.61,25.65 | v35.81,28.45 31.24,28.45 28.45,25.65 14.73,25.65 v13.21,24.13
R21  (via drill 0.3)
  Top 0.203: v34.04,19.3 30.73,22.61 LED21.RED
  Bottom 0.203: v34.04,19.3 35.31,18.03 41.66,18.03 42.42,18.8 46.99,18.8 IC1.4
R22
  Bottom 0.203: IC1.5 46.99,21.34 42.42,21.34 41.15,20.07 23.11,20.07 20.83,22.35 LED22.RED
R23  (via drill 0.3)
  Top 0.203: v30.48,16 32,17.53 42.42,17.53 46.74,13.21 46.74,11.94 46.48,11.68 46.48,11.18 48.51,9.14 51.82,9.14 54.36,11.68 54.36,21.34 53.09,22.61 51.56,22.61 50.29,23.88 49.53,23.88 IC1.6 | v13.21,20.32 13.21,21.84 12.7,22.35 LED23.RED
  Bottom 0.203: v30.48,16 28.19,13.72 28.19,13.46 27.43,12.7 20.83,12.7 19.3,14.22 19.3,14.48 13.46,20.32 v13.21,20.32
R24  (via drill 0.3)
  Top 0.203: v45.72,23.11 45.72,24.13 47.24,25.65 47.24,26.16 IC1.7 | v26.42,21.84 26.42,18.03 v25.65,17.27
  Bottom 0.203: v45.72,23.11 39.62,23.11 38.86,22.35 38.1,22.35 36.32,24.13 29.72,24.13 28.19,22.61 28.19,22.35 27.43,21.59 26.67,21.59 v26.42,21.84 | v25.65,17.27 24.13,15.75 18.8,15.75 13.46,21.08 5.59,21.08 4.06,22.61 LED24.RED
R31  (via drill 0.3)
  Top 0.203: v36.83,32.77 42.16,32.77 46.23,28.7 46.74,28.7 46.99,28.96 IC1.8
  Bottom 0.203: v36.83,32.77 36.58,32.77 36.32,33.02 31.75,33.02 30.73,32 LED31.RED
R32
  Bottom 0.203: IC1.9 47.24,32.26 46.23,33.27 39.62,33.27 38.1,34.8 24.64,34.8 21.84,32 LED32.RED
R33  (via drill 0.3)
  Top 0.203: v42.42,34.54 46.99,34.54 IC1.10 | v36.07,35.56 33.53,33.02 29.72,33.02 28.19,31.5 28.19,30.99 26.92,29.72 v26.92,29.21 | v18.29,29.21 15.24,29.21 12.95,31.5 LED33.RED
  Bottom 0.203: v42.42,34.54 41.66,35.31 36.32,35.31 v36.07,35.56 | v18.29,29.21 v26.92,29.21
R34  (via drill 0.3)
  Top 0.203: v45.47,38.1 45.47,38.61 47.75,40.89 49.28,40.89 50.04,41.66 50.04,42.16 49.28,42.93 v35.31,42.93 | v28.7,43.43 27.94,44.2 24.89,44.2 24.64,43.94 5.08,43.94 2.29,41.15 2.29,32.77 2.79,32.26 LED34.RED
  Bottom 0.203: v45.47,38.1 46.48,37.08 46.99,37.08 IC1.11 | v35.31,42.93 29.21,42.93 v28.7,43.43
R41  (via drill 0.3)
  Top 0.203: v33.27,37.85 41.66,37.85 42.16,37.34 45.72,37.34 47.24,38.86 IC1.12
  Bottom 0.203: v33.27,37.85 30.73,40.39 LED41.RED
R42  (via drill 0.3)
  Top 0.203: v35.05,38.61 35.31,38.35 41.91,38.35 42.16,38.1 43.43,38.1 46.99,41.66 IC1.13 | v22.35,37.34 22.35,39.37 21.59,40.13 LED42.RED
  Bottom 0.203: v35.05,38.61 33.53,37.08 25.15,37.08 24.89,37.34 v22.35,37.34
R43  (via drill 0.3)
  Top 0.203: v24.64,36.58 28.19,40.13 28.19,40.39 29.72,41.91 33.27,41.91 35.05,43.69 35.81,43.69 36.07,43.43 43.94,43.43 44.7,44.2 46.99,44.2 IC1.14 | v20.32,35.81 17.53,35.81 v14.99,38.35
  Bottom 0.203: v24.64,36.58 21.08,36.58 v20.32,35.81 | v14.99,38.35 12.95,40.39 LED43.RED
R44  (via drill 0.3)
  Top 0.203: v43.94,50.55 v45.47,49.02
  Bottom 0.203: v45.47,49.02 45.47,48.26 41.91,44.7 IC1.15 | v43.94,50.55 34.54,50.55 33.02,52.07 18.29,52.07 8.13,41.91 5.08,41.91 4.06,40.89 LED44.RED
RESET  (via drill 0.3)
  Top 0.203: SWRESET.1 41.91,47.5 36.83,47.5 SWRESET.2 35.56,46.99 33.27,44.7 28.19,44.7 v27.18,45.72 | v24.13,45.97 24.38,45.97 25.91,47.5 28.7,47.5 31.24,50.04 32.51,50.04 JP2.6
  Bottom 0.203: v24.13,45.97 26.92,45.97 v27.18,45.72
SCLK  (via drill 0.3)
  Top 0.203: JP12.2 64.01,4.57 65.02,4.57 65.79,3.81 68.83,3.81 69.85,2.79 69.85,2.29 71.63,0.51 73.91,0.51 77.98,4.57 JP21.1 | v46.48,20.32 46.74,20.32 46.99,20.07 50.04,20.07 50.8,19.3 IC2.25 | v63.25,8.64 60.45,8.64 57.91,11.18 57.91,16.76 59.18,18.03 61.47,18.03 62.23,18.8 IC3.25
  Bottom 0.203: v46.48,20.32 43.69,20.32 42.67,19.3 41.91,19.3 IC1.25 | IC3.25 62.23,18.8 61.47,18.8 60.71,18.03 54.1,18.03 53.34,18.8 IC2.25 | v63.25,8.64 63.25,5.59 JP12.2
SCLK_DEF  (via drill 0.3)
  Top 0.203: v36.58,5.59 19.05,5.59 16.26,2.79 15.75,2.79 JP4.6 | v38.86,5.84 42.42,5.84 46.74,1.52 52.83,1.52 53.59,2.29 53.59,2.54 54.1,3.05 56.64,3.05 58.17,1.52 62.48,1.52 62.99,2.03 JP13.2
  Bottom 0.203: v36.58,5.59 38.61,5.59 v38.86,5.84
SIN  (via drill 0.3)
  Top 0.203: v45.72,17.02 47.75,14.99 49.28,14.99 50.29,13.97 50.29,10.92 v51.31,9.91
  Bottom 0.203: v45.72,17.02 44.96,17.78 44.45,17.78 43.43,16.76 41.91,16.76 IC1.26 | v51.31,9.91 55.63,5.59 60.45,5.59 JP12.1
SIN_DEF  (via drill 0.3)
  Top 0.203: v58.17,4.32 59.69,2.79 60.45,2.79 JP13.1
  Bottom 0.203: v58.17,4.32 43.94,4.32 43.18,5.08 37.08,5.08 36.07,4.06 12.45,4.06 11.18,2.79 10.67,2.79 JP4.4
SOUT
  Bottom 0.203: IC3.17 69.09,39.37 70.61,40.89 73.66,40.89 78.23,45.47 79.25,45.47 79.76,44.96 79.76,34.29 77.72,32.26 77.72,31.24 78.74,30.23 79.25,30.23 80.26,29.21 80.26,12.45 79.25,11.43 78.23,11.43 76.71,9.91 JP20.3
SW1_DEF  (via drill 0.3)
  Top 0.203: v45.21,1.27 44.7,0.76 31.75,0.76 30.23,2.29 29.72,2.29 JP5.3 | v59.94,3.56 60.2,3.56 60.45,3.81 64.77,3.81 65.53,3.05 JP13.3
  Bottom 0.203: v45.21,1.27 51.82,1.27 52.07,1.02 56.13,1.02 58.67,3.56 v59.94,3.56
SW2_DEF  (via drill 0.3)
  Top 0.203: v54.36,2.29 55.63,1.02 66.04,1.02 67.06,2.03 68.07,2.03 JP13.4
  Bottom 0.203: v54.36,2.29 53.59,2.29 52.07,3.81 42.93,3.81 42.16,4.57 37.34,4.57 35.81,3.05 34.8,3.05 JP5.5
SW3_DEF  (via drill 0.3)  (1 unrouted)
  Top 0.203: v57.4,3.3 v58.42,2.29 | v69.6,4.06 70.61,3.05 JP13.5
  Bottom 0.203: 42.42,2.03 51.82,2.03 52.32,1.52 55.63,1.52 v57.4,3.3 | v58.42,2.29 59.69,2.29 60.71,1.27 66.29,1.27 67.31,2.29 67.31,2.79 68.33,3.81 69.34,3.81 v69.6,4.06
VCC  (via drill 0.3)
  Top 0.203: IC1.21 41.91,28.96 45.21,28.96 45.97,28.19 50.04,28.19 50.8,28.96 IC2.21 | v16.26,42.67 17.02,41.91 18.54,41.91 19.56,40.89 v19.56,37.34 | v19.56,32.77 19.56,31.75 v21.34,29.97 | C1.1 46.23,8.64 47.5,8.64 49.02,7.11 55.12,7.11 56.64,8.64 C2.1 | v66.04,10.41 66.8,10.41 68.07,9.14 C3.1 | 43.69,33.78 46.74,33.78 47.24,33.27 50.04,33.27 50.8,34.04 IC2.19 53.34,34.54 55.88,37.08 v57.4,37.08 | 43.69,33.78 42.16,33.78 41.91,34.04 IC1.19 | IC3.21 64.52,29.72 64.52,30.73 65.28,31.5 65.28,33.02 64.52,33.78 IC3.19 | R4.2 74.68,28.7 v74.68,27.43 74.68,20.83 76.2,19.3 v76.2,16.26 | v56.9,38.61 56.9,41.66 53.34,45.21 53.34,48.77 51.31,50.8 50.55,50.8 49.53,49.78 48.77,49.78 JP11.1 | v45.97,31.5 43.69,33.78
  Bottom 0.203: v16.26,42.67 19.56,45.97 19.81,45.97 23.37,49.53 25.65,49.53 26.16,50.04 27.43,50.04 JP2.4 | v19.56,32.77 v19.56,37.34 | v21.34,29.97 27.18,29.97 28.45,28.7 29.46,28.7 30.48,29.72 39.62,29.72 IC1.21 | C3.1 69.09,9.14 72.39,9.14 75.69,12.45 JP20.4 76.2,13.21 v76.2,16.26 | v66.04,10.41 64.01,10.41 60.45,6.86 58.67,6.86 58.17,7.37 58.17,7.62 57.4,8.38 C2.1 | v74.68,27.43 72.39,27.43 71.63,28.19 65.02,28.19 64.52,28.7 IC3.21 | v56.9,38.61 56.9,37.59 v57.4,37.08 59.18,35.31 61.47,35.31 62.23,34.54 IC3.19 | v45.97,31.5 46.74,30.73 49.53,30.73 50.8,29.46 IC2.21
VLED  (via drill 0.3)
  Top 0.203: 14.22,36.32 14.22,40.13 LED43.GND | 14.22,36.32 14.22,32.26 LED33.GND 14.99,32 16.51,33.53 21.34,33.53 22.61,32.26 LED32.GND | 14.22,17.53 14.22,22.35 LED23.GND | 14.22,17.53 14.22,14.48 LED13.GND | 5.33,17.53 5.33,22.35 LED24.GND | 5.33,17.53 5.33,14.48 LED14.GND | 5.33,36.32 5.33,40.13 LED44.GND | 5.33,36.32 5.33,32.26 LED34.GND | 5.33,17.53 14.22,17.53 | 5.33,36.32 14.22,36.32 | LED32.GND 23.11,32.26 23.11,40.13 LED42.GND | LED41.GND 31.5,40.13 23.62,32.26 LED32.GND | v28.7,45.47 30.99,45.47 34.04,48.51 42.93,48.51 44.96,46.48 46.74,46.48 49.53,49.28 50.29,49.28 JP11.2 | LED21.GND 32,23.37 32,31.24 LED31.GND | 23.11,15.24 23.11,22.35 LED22.GND 23.11,23.37 23.11,31.24 LED32.GND | 23.11,15.24 23.11,14.48 LED12.GND | 23.11,15.24 30.73,15.24 31.5,14.48 LED11.GND 32.77,13.72 33.78,12.7 33.78,12.45 36.32,9.91 36.32,7.37 40.64,3.05 v40.64,2.03 | v72.14,1.27 75.44,4.57 JP20.1
  Bottom 0.203: LED24.GND 5.33,23.37 5.33,31.24 LED34.GND | v28.7,45.47 25.15,41.91 24.89,41.91 23.88,40.89 LED42.GND | v72.14,1.27 70.36,1.27 69.6,0.51 42.16,0.51 v40.64,2.03 | LED21.GND 31.5,22.35 30.23,21.08 25.4,21.08 23.88,22.61 LED22.GND
XLAT  (via drill 0.3)
  Top 0.203: v16.76,10.92 20.07,14.22 20.07,17.53 22.61,20.07 22.61,21.59 v22.35,21.84 | JP21.2 78.23,7.87 77.72,7.87 76.71,8.89 70.61,8.89 66.04,13.46 66.04,16 65.79,16.26 65.79,19.81 64.52,21.08 IC3.24
  Bottom 0.203: IC3.24 62.23,21.34 61.47,21.34 60.71,20.57 54.61,20.57 53.34,21.84 IC2.24 50.8,21.84 50.04,21.84 49.28,22.61 47.24,22.61 46.48,21.84 41.91,21.84 IC1.24 39.37,21.34 38.61,20.57 23.62,20.57 v22.35,21.84 | v16.76,10.92 13.72,10.92 5.59,2.79 JP4.2

### Text on the board
tPlace: Vled | A5 | A4 | A3 | A2 | A1 | A0 | Vin | Gnd | Gnd | 5V | 3.3V | RST | RESET | SW1 | SW2 | SW3 | VCC | (C) 2009 Ben Combee, (CC)-BY-SA 3.0 | 4,4 | 4,1 | R1-R | R3-B | combee.net/rgbshield | IC3 BLUE | 10K | IC1 RED | IC2 GREEN | R2-G | GSCLK | VCC | RGB LED Shield v1.3 | SOUT | BLANK | 1,4 | 1,1 | SIN | SCLK | SW1 | SW2 | SW3 | GND | XLAT | a HTINK design | RX | TX | SW1 | GSCLK | SW2 | D5* | D6* | SW3 | D8 | BLANK | XLAT | SOUT | D12 | SCLK | GND | AREF | VLED | SCLK